# EAGLE design Enclosure 85x58 (EAGLE 9.6.1)
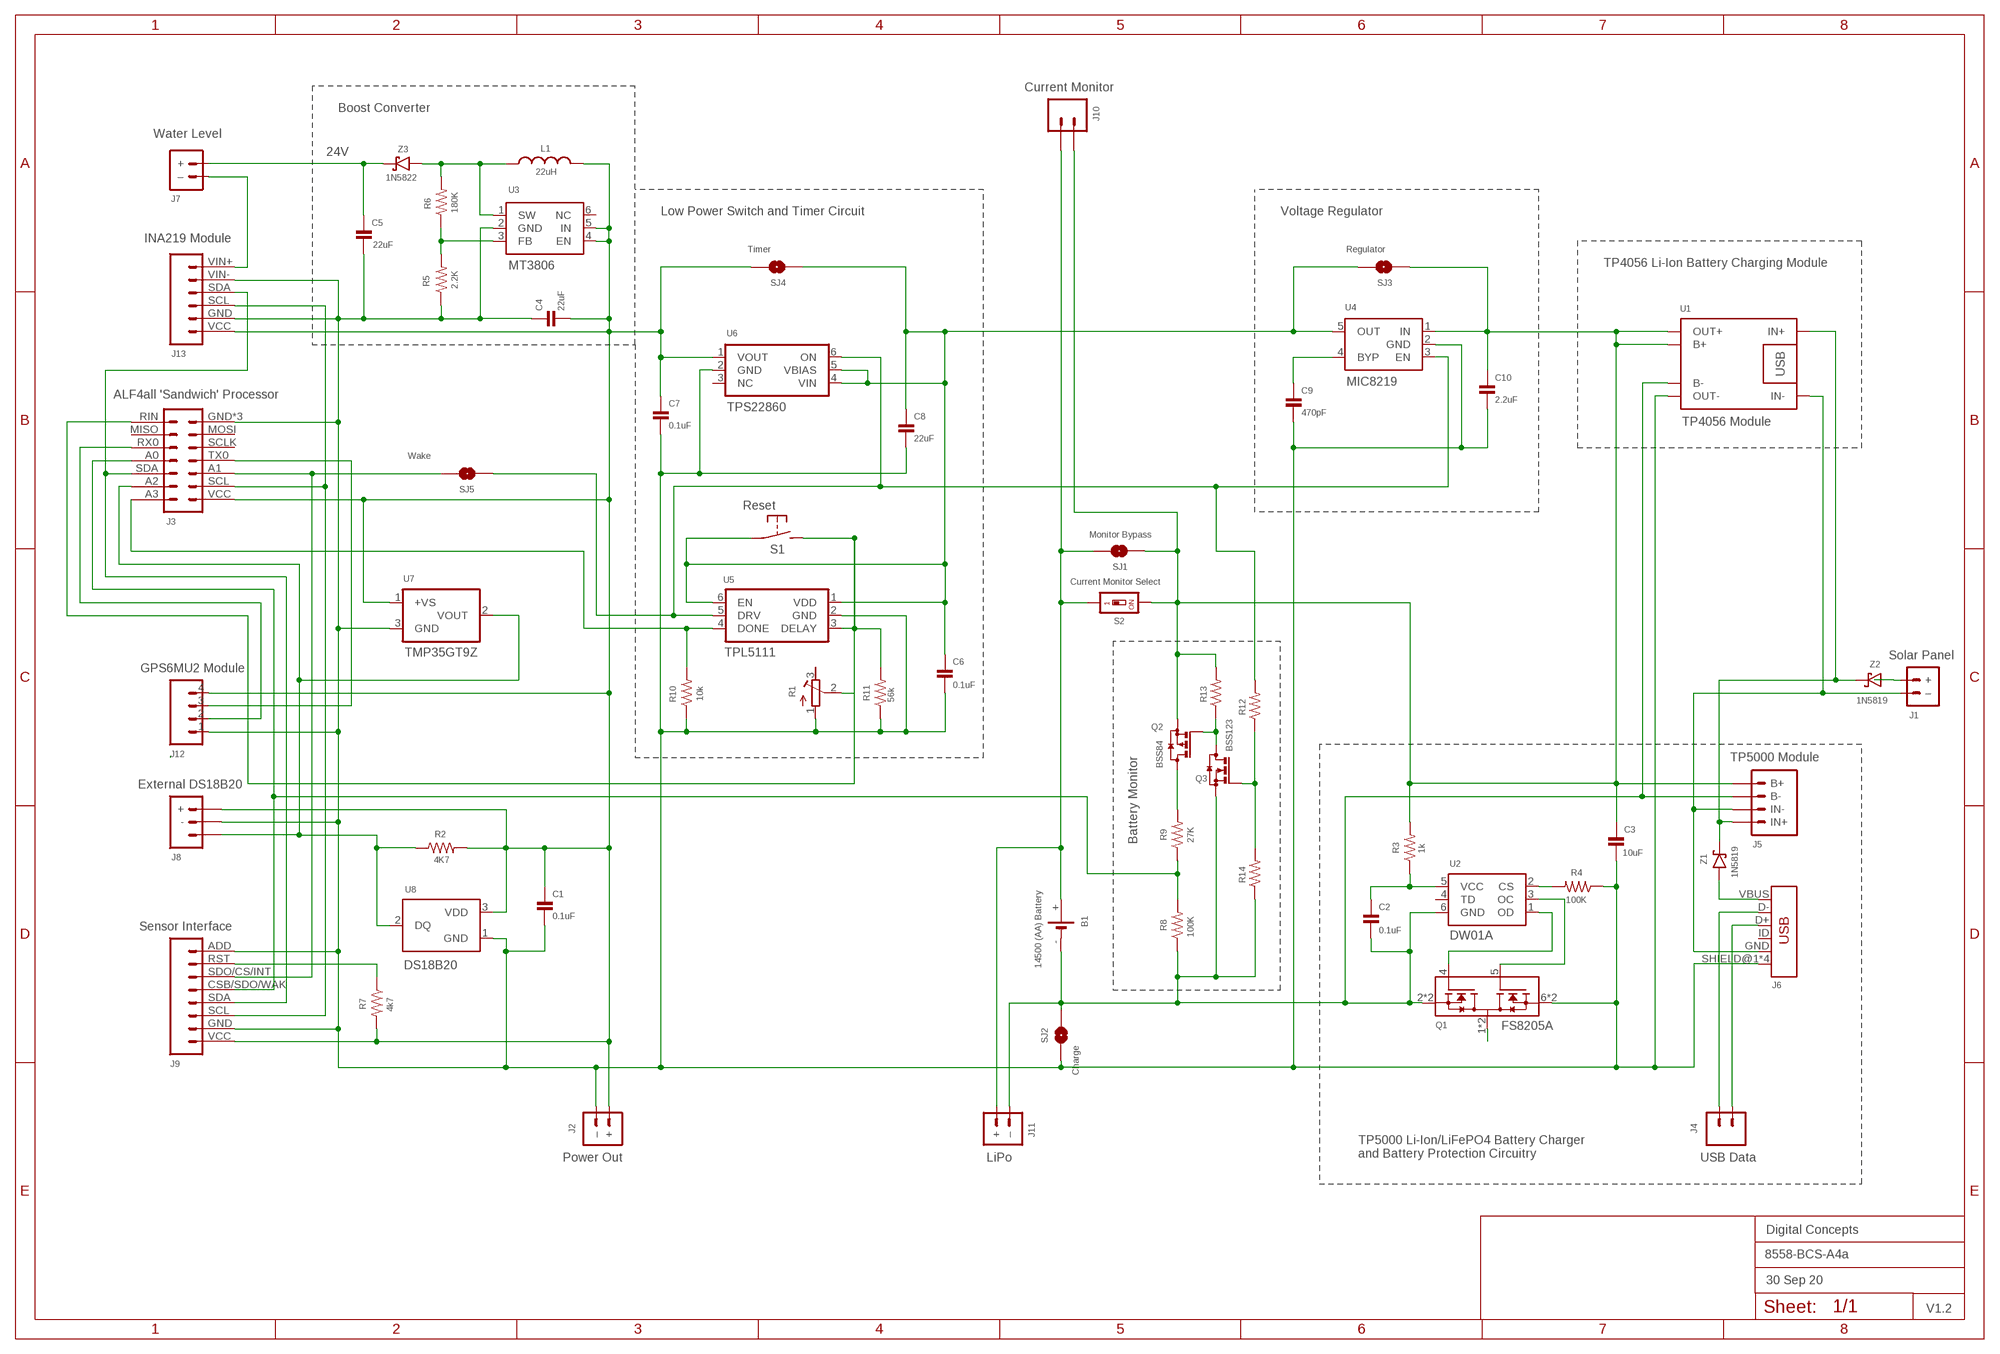
[diagram p0: schematic, sheet 1]
FRAME2 (A3L-LOC): DATE: 30 Sep 20; OWNER: Digital Concepts; TITLE: 8558-BCS-A4a; VERSION: V1.2

## Parts
B1  14500 (AA) Battery  BATTERY-HOLDER-14500(AA)  [BATTERY-14500]
C1  0.1uF  CAPACITOR-VIA-2  [C0805-VIA-2]
C2  0.1uF  CAPACITOR-VIA-1  [C0805-VIA-1]
C3  10uF  CAPACITOR-VIA-2  [C0805-VIA-2]
C4  22uF  CAPACITOR-VIA-1  [C0805-VIA-1]
C5  22uF  CAPACITOR  [C0805]
C6  0.1uF  CAPACITOR  [C0805]
C7  0.1uF  CAPACITOR-VIA-1  [C0805-VIA-1]
C8  22uF  CAPACITOR-VIA-2  [C0805-VIA-2]
C9  470pF  CAPACITOR  [C0805]
C10  2.2uF  CAPACITOR-VIA-2  [C0805-VIA-2]
J1  Solar Panel  JST-PH2.0-2-MALE-VERTICAL  [JST-PH2.0-2-VERTICAL]
J2  Power Out  JST-PH1.25-2-MALE  [JST-PH1.25-2]
J3  ALF4all 'Sandwich' Processor  HEADER-2X7-ALF4ALL-PROCESSOR  [CONN_2X7-ALF4ALL-PROCESSOR]
J4  USB Data  1X2-PIN-HEADER  [CONN_02-GENERIC]
J5  TP5000 Module  TP5000-MODULE  [CONN_04-GENERIC]
J6  USB  USB_MINI-B_SMT  [USB-MINIB]
J7  Water Level  JST-PH2.0-2-MALE-VERTICAL  [JST-PH2.0-2-VERTICAL]
J8  External DS18B20  JST-PH2.0-3-MALE-VERTICAL  [JST-PH2.0-3-VERTICAL]
J9  Sensor Interface  HEADER-1X8-SENSOR  [CONN_08-SENSOR]
J10  Current Monitor  JST-PH2.0-2-MALE-HORIZONTALJST-PTH-2  [JST-PH2.0-2-HORIZONTAL]
J11  LiPo  JST-PH2.0-2-MALE-VERTICAL  [JST-PH2.0-2-VERTICAL]
J12  GPS6MU2 Module  HEADER-1X4-GENERIC  [CONN_04-GENERIC]
J13  INA219 Module  INA219-I2C-MODULE  [CONN_06-INA219]
L1  22uH  INDUCTORL5038P  [L5038P]
Q1  FS8205A  [SOP65P640X120-8N]
Q2  BSS84  [SOT23]
Q3  BSS123  [SOT23]
R1  RESISTOR-TRIMM64W  [RTRIM64W]
R2  4K7  RESISTORR0805  [R0805]
R3  1k  RESISTORR0805  [R0805]
R4  100K  RESISTORR0805  [R0805]
R5  2.2K  RESISTOR-VIA-1  [R0805-VIA-1]
R6  180K  RESISTORR0805  [R0805]
R7  4k7  RESISTORR0805  [R0805]
R8  100K  RESISTORR0805  [R0805]
R9  27K  RESISTOR-VIA-12  [R0805-VIA-12]
R10  10k  RESISTOR-VIA-2  [R0805-VIA-2]
R11  56k  RESISTOR-VIA-1  [R0805-VIA-1]
R12  RESISTORR0805  [R0805]
R13  RESISTORR0805  [R0805]
R14  RESISTORR0805  [R0805]
S1  Reset  SWITCH-MOMENTARY-2-PIN-VIAS  [SWITCH-2-PAD-VIAS]
S2  Current Monitor Select  SWITCH-DIP-SWS001-VIA-1  [SMD-001-VIA-1]
SJ1  Monitor Bypass  SJ  [SJ]
SJ2  Charge  SJ-V-2  [SJ-VIA-2]
SJ3  Regulator  SJ-V-1  [SJ-VIA-1]
SJ4  Timer  SJ  [SJ]
SJ5  Wake  SJ-V-1  [SJ-VIA-1]
U1  TP4056 Module  BATTERY-CHARGER-LI-PROT  [BATTERY-CHARGER-LI-PROT]
U2  DW01A  [SOT23-6]
U3  MT3806  [SOT-23-6]
U4  MIC8219  MIC5219XX  [SOT-23-5]
U5  TPL5111  TPL5111DDCR  [SOT-23-6]
U6  TPS22860  [SOT-23-6]
U7  TMP35GT9Z  [TO-92]
U8  DS18B20  [TO-92]
Z1  1N5819  1N5819-SOD-123  [SOD-123]
Z2  1N5819  1N5819-SOD-123  [SOD-123]
Z3  1N5822  1N5819-SOD-123  [SOD-123]

## Nets
GND: C1.2 C1.2@VIA C3.2 C3.2@VIA C4.1 C4.1@VIA C5.2 C6.1 C7.1 C7.1@VIA C8.2 C8.2@VIA C9.2 C10.1 J2.-(–) J3.GND J3.GND@TL J3.GND@TR J6.SHIELD@1(SHIELD) J6.SHIELD@2(SHIELD) J6.SHIELD@3(SHIELD) J6.SHIELD@4(SHIELD) J8.- J9.ADD J9.GND J12.1 J13.GND J13.VIN- Q1.6(S2) Q1.7(S2) R1.1(A) R4.1 R5.1 R5.1@VIA R10.1 R11.1 R11.1@VIA SJ2.1 SJ2.1@V U1.OUT- U3.2(GND) U4.2(GND) U5.2(GND) U6.2(GND) U7.3(GND) U8.1(GND)
N$1: J1.+ Z2.A
N$2: J1.-(–) J5.2(IN-) J6.GND U1.IN-
N$3: R4.2 U2.2(CS)
N$4: Q1.1(D12) Q1.8(D12)
N$5: J5.1(IN+) U1.IN+ Z1.C Z2.C
N$6: L1.1 R6.2 U3.1(SW) Z3.A
N$7: C9.1 U4.4(BYP)
N$8: J3.SCL J9.SCL J13.SCL
N$9: J9.RST R7.1
N$10: J3.A0 J9.CSB/SDO/WAK R8.2 R9.1 R9.1@VIA
N$11: J3.SDA J9.SDA J13.SDA
N$12: B1.+ J10.+ J11.+ S2.1 S2.1@VIA SJ1.1
N$13: J3.A2 J8.SIG R2.1 U7.2(VOUT) U8.2(DQ)
N$14: J3.TX0 J12.3
N$15: J7.-(–) J13.VIN+
N$16: J3.RX0 J12.2
N$18: Q1.5(G2) U2.3(OC)
N$19: J6.VBUS Z1.A
N$20: Q1.4(G1) U2.1(OD)
N$21: J4.2 J6.D+
N$22: C2.1 C2.1@VIA R3.1 U2.5(VCC)
N$23: Q2.3(D) R9.2 R9.2@VIA
N$24: J4.1 J6.D-
N$25: J3.RIN R1.2(S) R11.2 S1.2(S) S1.2@VIA(S) U5.3(DELAY)
N$26: C6.2 C8.1 S1.1(P) S1.1@VIA(P) SJ3.2 SJ4.2 U4.5(OUT) U5.1(VDD) U5.6(EN) U6.4(VIN) U6.5(VBIAS)
N$28: R12.2 SJ5.2 U4.3(EN) U5.5(DRV) U6.6(ON)
N$29: J3.A3 R10.2 R10.2@VIA U5.4(DONE)
N$30: J3.A1 J9.SDO/CS/INT SJ5.1 SJ5.1@V
N$31: C5.1 J7.+ Z3.C
N$33: R5.2 R6.1 U3.3(FB)
N$34: C3.1 C10.2 C10.2@VIA J5.4(B+) J10.- Q2.2(S) R3.2 R13.2 S2.2 SJ1.2 SJ3.1 SJ3.1@V U1.B+ U1.OUT+ U4.1(IN)
N$35: Q2.1(G) Q3.3(D) R13.1
N$37: Q3.1(G) R12.1 R14.2
N$38: B1.- C2.2 J5.3(B-) J11.-(–) Q1.2(S1) Q1.3(S1) Q3.2(S) R8.1 R14.1 SJ2.2 SJ2.2@V U1.B- U2.6(GND)
VCC: C1.1 C4.2 C7.2 J2.+ J3.VCC J8.+ J9.VCC J12.4 J13.VCC L1.2 R2.2 R7.2 SJ4.1 U3.4(EN) U3.5(IN) U6.1(VOUT) U7.1(+VS) U8.3(VDD)
Unconnected: J3.MISO J3.MOSI J3.SCLK J6.ID R1.3(E) U2.4(TD) U3.6(NC) U6.3(NC)

## Notes on the sheet
- Boost Converter
- 24V
- Low Power Switch and Timer Circuit | Voltage Regulator
- TP4056 Li-Ion Battery Charging Module
- Battery Monitor
- TP5000 Li-Ion/LiFePO4 Battery Charger
  and Battery Protection Circuitry

## Library data of the parts
B1 = digitalconcepts:BATTERY-HOLDER-14500(AA): 14500 (AA) battery holder
C1 C3 C8 C10 = digitalconcepts:CAPACITOR-VIA-2: 0805 Capacitor with via on Pad 2
C2 C4 C7 = digitalconcepts:CAPACITOR-VIA-1: 0805 Capacitor with via
C5 C6 C9 = digitalconcepts:CAPACITOR: 0805 Capacitor
J1 J7 J11 = digitalconcepts:JST-PH2.0-2-MALE-VERTICAL: PH2.0 Male PCB Connector
J2 = digitalconcepts:JST-PH1.25-2-MALE: PH1.25 Male PCB Connector
J3 = digitalconcepts:HEADER-2X7-ALF4ALL-PROCESSOR: ALF4all 'Sandwixh' Processor 2x7 Pin Header and earthed 1x1 locator pins for ALF4all 'Sandwich' Processor/RFM95W PCBs
J4 = digitalconcepts:1X2-PIN-HEADER: Single Row 2-Pin Header
J5 = digitalconcepts:TP5000-MODULE: TP5000 Module Pin Header
J6 = digitalconcepts:USB_MINI-B: USB Mini-B Connector Breaks out 5 pins, and includes shield pins if needed.
J8 = digitalconcepts:JST-PH2.0-3-MALE-VERTICAL: PH2.0 Male PCB Connector
J9 = digitalconcepts:HEADER-1X8-SENSOR: IoT Sensors 1x8 Pin Header for 'Sandwich' IoT Sensors
J10 = digitalconcepts:JST-PH2.0-2-MALE-HORIZONTAL: Multi connection point. Often used as Generic Header-pin footprint for 0.1 inch spaced/style header connections On any of the 0.1 inch spaced packages, you can populate with these: Break Away Headers - Straight <https://www.sparkfun.com/products/116> (PRT-00116) Break Away Male Headers - Right Angle <https://www.sparkfun.com/products/553> (PRT-00553) Female Headers <https://www.sparkfun.com/products/115> (PRT-00115) Break Away Headers - Machine Pin <https://www.sparkfun.com/products/117> (PRT-00117) Break Away Female Headers - Swiss Machine Pin <https://www.sparkfun.com/products/743> (PRT-00743) For SCREWTERMINALS and SPRING TERMINALS visit here: Screw Terimnals on SparkFun.com <https://www.sparkfun.com/search/results?term=Screw+Terminals> (5mm/3.5mm/2.54mm spacing) This device is also useful as a general connection point to wire up your design to another part of your project. Our various solder wires solder well into these plated through hole pads. Hook-Up Wire - Assortment (Stranded, 22 AWG) <https://www.sparkfun.com/products/11375> (PRT-11375) Hook-Up Wire - Assortment (Solid Core, 22 AWG) <https://www.sparkfun.com/products/11367> (PRT-11367) View the entire wire category on our website here <https://www.sparkfun.com/categories/141> Special notes: Molex polarized connector foot print use with: PRT-08233 with associated crimp pins and housings. 2.54_SCREWTERM for use with PRT-10571. 3.5mm Screw Terminal footprints for PRT-08084 5mm Screw Terminal footprints for use with PRT-08432; PROD_ID: CONN-09863; SKU: PRT-09914
J12 = digitalconcepts:HEADER-1X4-GENERIC: Single Row 4-Pin Header
J13 = digitalconcepts:INA219-I2C-MODULE: INA219 I2C Module
L1 = digitalconcepts:INDUCTOR: Inductor; SPICEPREFIX: L
Q1 = FS8205A:FS8205A: N/A; AVAILABILITY: Unavailable; MF: Fortune Semiconductor; MP: FS8205A; PACKAGE: Package; PRICE: None
Q2 = digitalconcepts:BSS84: P-CHANNEL MOS FET
Q3 = digitalconcepts:BSS123: N-CHANNEL MOS FET
R1 = digitalconcepts:RESISTOR-TRIMM: Trimm resistor
R2-R4 R6-R8 R12-R14 = digitalconcepts:RESISTOR: Resistor; SPICEPREFIX: R
R5 R11 = digitalconcepts:RESISTOR-VIA-1: Resistor with via on Pad 1
R9 = digitalconcepts:RESISTOR-VIA-12: Resistor with vias on each pad
R10 = digitalconcepts:RESISTOR-VIA-2: Resistor with via on Pad 2
S1 = digitalconcepts:SWITCH-MOMENTARY-2-PIN-VIAS: 2 Pin Momentary Switch
S2 = digitalconcepts:SWITCH-DIP-SWS001-VIA-1: SMD Dip Switch 1 pol.
SJ1 SJ4 = digitalconcepts:SJ: Solder Jumper
SJ2 = digitalconcepts:SJ-V-2: Solder Jumper with Pad Vias
SJ3 SJ5 = digitalconcepts:SJ-V-1: Solder Jumper with single Pad Via
U1 = digitalconcepts:BATTERY-CHARGER-LI-PROT: TP4056 Li Battery Charger module with PCB (rather than module) footprint
U2 = DW01A:DW01A; AVAILABILITY: Unavailable; DESCRIPTION: One Cell Lithium-ion/Polymer Battery Protection IC; MF: Fortune Semiconductor; MP: DW01A; PACKAGE: SOT-23-6 Fortune Semiconductor; PRICE: None
U3 = digitalconcepts:MT3806: MT3806 DC-DC Step-Up Voltage Converter
U4 = digitalconcepts:MIC5219XX: VOLTAGE REGULATOR; OC_FARNELL: unknown; OC_NEWARK: unknown
U5 = digitalconcepts:TPL5111DDCR: TPL5111 Nano-Power System Timer
U6 = digitalconcepts:TPS22860: Texas Instruments TPS22860 Ultra-Low Leakage Load Switch
U7 = digitalconcepts:TMP35GT9Z: Temperature Sensor; AVAILABILITY: Warning; DESCRIPTION: Temperature Sensor Analog, Local 10°C ~ 125°C 10mV/°C TO-92-3; MF: Analog Devices; MOUSER-PURCHASE-URL: https://snapeda.com/shop?store=Mouser&id=409845; MP: TMP35GT9Z; PACKAGE: TO-92-3 Analog Devices; PRICE: None
U8 = digitalconcepts:DS18B20: Digital Thermometer -55C-125C TO92-3; AVAILABILITY: Bad; DESCRIPTION: Temperature Sensor Digital, Local -55°C ~ 125°C 12 b 8-uMAX; MF: Maxim Integrated; MP: DS18B20; PACKAGE: TO-92 Maxim Integrated; PRICE: None
Z1-Z3 = digitalconcepts:1N5819-SOD-123: 1N5819 Schottky Diode SOD-123

## Board
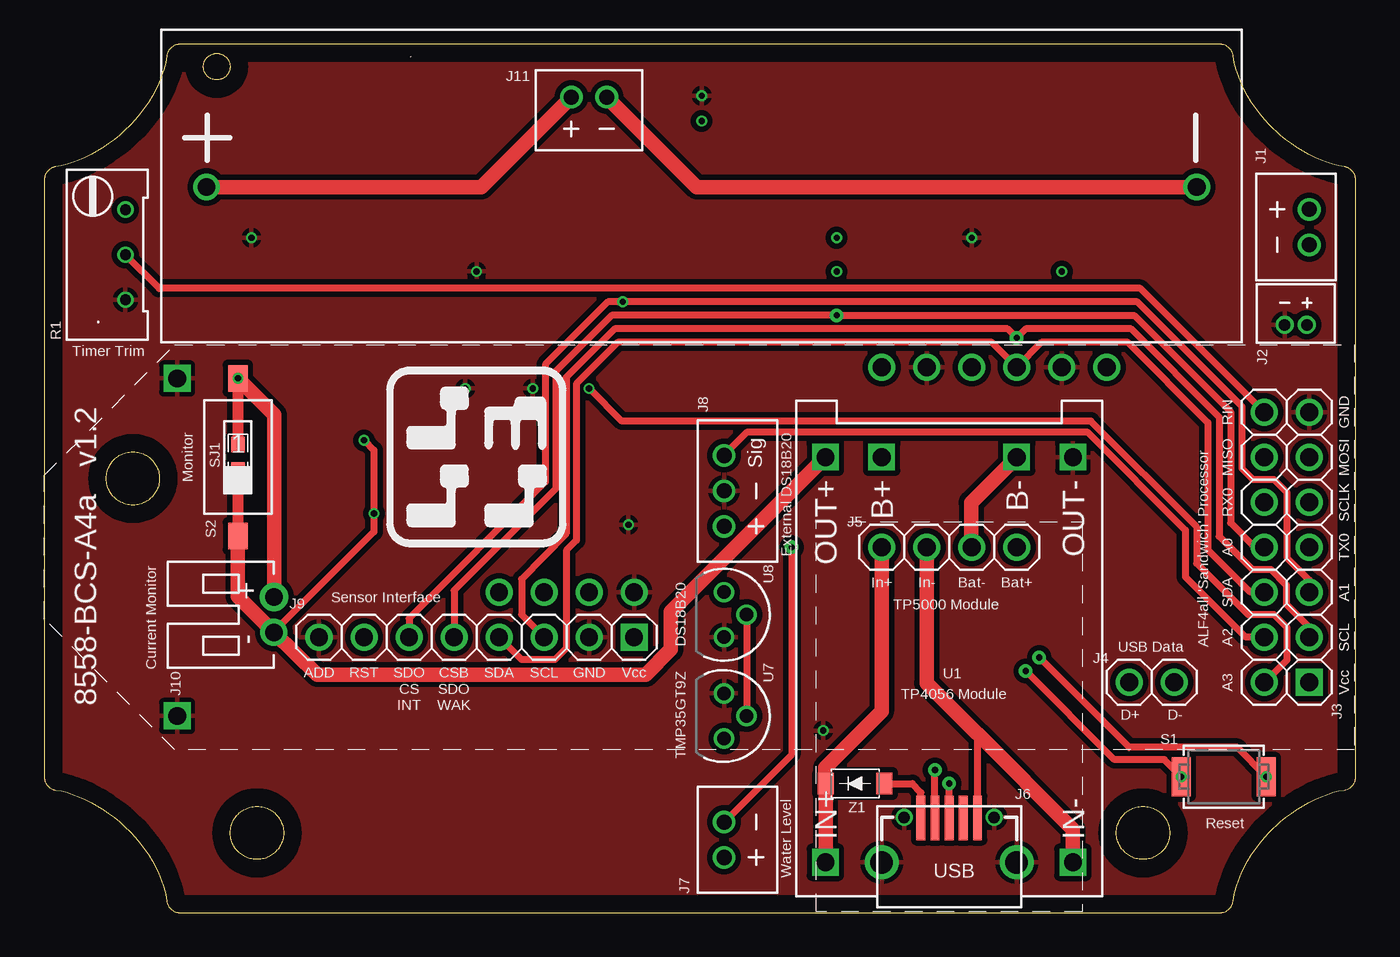
[diagram p1: board, top side]
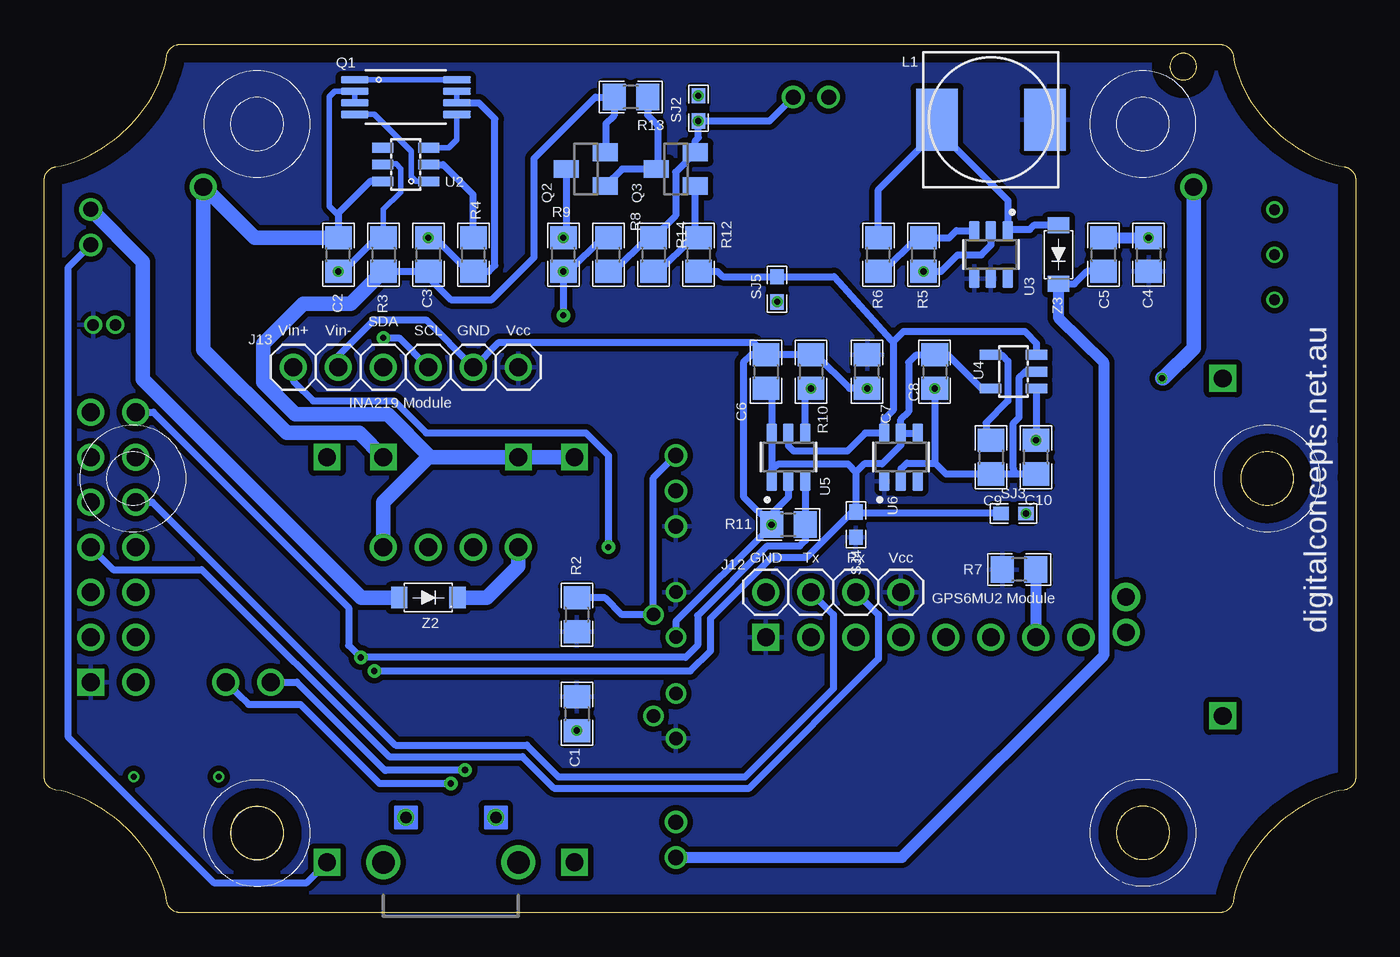
[diagram p2: board, bottom side, seen from below]

Size 74 x 49 mm. Coordinates in mm from the lower left corner, seen from the top.
Outline: 7.52,48.99 7.48,48.98 7.43,48.97 7.39,48.95 7.35,48.94 7.31,48.92 7.27,48.89 7.24,48.87 7.2,48.85 7.17,48.82 7.13,48.79 7.1,48.76 7.08,48.73 7.05,48.69 7.02,48.66 7,48.62 6.98,48.58 6.96,48.54 6.95,48.5 6.93,48.46 6.92,48.41 6.92,48.37 6.85,47.96 6.75,47.57 6.61,47.18 6.47,46.8 6.29,46.43 6.09,46.08 5.88,45.72 5.65,45.38 5.39,45.06 5.13,44.74 4.85,44.44 4.55,44.16 4.26,43.88 3.94,43.62 3.62,43.39 3.3,43.16 2.96,42.95 2.63,42.78 2.29,42.6 1.96,42.45 1.62,42.33 1.29,42.22 0.96,42.13 0.64,42.09 0.59,42.08 0.55,42.07 0.51,42.05 0.47,42.04 0.43,42.02 0.39,42 0.35,41.98 0.31,41.96 0.28,41.93 0.25,41.9 0.22,41.87 0.16,41.81 0.13,41.77 0.11,41.73 0.09,41.7 0.07,41.66 0.05,41.61 0.03,41.57 0.02,41.53 0.01,41.48 0,41.44 0,41.39 0,41.34 0,41.33 0,26.66 0,24.57 0,7.61 0,7.56 0.01,7.52 0.02,7.47 0.03,7.43 0.05,7.39 0.07,7.34 0.09,7.31 0.11,7.27 0.13,7.23 0.16,7.19 0.19,7.16 0.22,7.13 0.25,7.1 0.28,7.07 0.31,7.04 0.35,7.02 0.43,6.98 0.47,6.96 0.51,6.95 0.55,6.93 0.59,6.92 0.64,6.91 0.96,6.87 1.29,6.78 1.62,6.67 1.96,6.55 2.29,6.4 2.63,6.22 2.96,6.05 3.3,5.84 3.62,5.61 3.94,5.38 4.26,5.12 4.55,4.84 4.85,4.56 5.13,4.26 5.39,3.94 5.65,3.62 5.88,3.28 6.09,2.92 6.29,2.57 6.47,2.2 6.61,1.82 6.75,1.43 6.85,1.04 6.92,0.63 6.92,0.59 6.93,0.54 6.95,0.5 6.96,0.46 6.98,0.42 7,0.38 7.02,0.34 7.05,0.31 7.08,0.28 7.1,0.24 7.13,0.21 7.17,0.18 7.2,0.15 7.24,0.13 7.27,0.11 7.31,0.08 7.35,0.06 7.39,0.05 7.43,0.03 7.48,0.02 7.52,0.01 7.56,0 7.61,0 66.39,0 66.43,0 66.48,0.01 66.52,0.02 66.57,0.03 66.65,0.06 66.69,0.08 66.73,0.11 66.76,0.13 66.8,0.15 66.87,0.21 66.9,0.24 66.92,0.28 66.95,0.31 66.98,0.34 67.02,0.42 67.04,0.46 67.05,0.5 67.07,0.54 67.08,0.59 67.08,0.63 67.14,1.04 67.25,1.43 67.39,1.82 67.53,2.2 67.71,2.57 67.91,2.92 68.12,3.28 68.35,3.62 68.61,3.94 68.87,4.26 69.15,4.56 69.74,5.12 70.06,5.38 70.38,5.61 70.7,5.84 71.03,6.05 71.37,6.22 71.71,6.4 72.04,6.55 72.38,6.67 72.71,6.78 73.04,6.87 73.36,6.91 73.41,6.92 73.45,6.93 73.53,6.96 73.57,6.98 73.65,7.02 73.68,7.04 73.72,7.07 73.75,7.1 73.78,7.13 73.81,7.16 73.84,7.19 73.87,7.23 73.89,7.27 73.91,7.31 73.93,7.34 73.95,7.39 73.97,7.43 73.98,7.47 73.99,7.52 73.99,7.56 74,7.61 74,14.51 74,16.35 74,24.49 74,26.59 74,41.39 74,41.44 73.99,41.48 73.98,41.53 73.97,41.57 73.95,41.61 73.93,41.66 73.91,41.7 73.89,41.73 73.87,41.77 73.84,41.81 73.81,41.84 73.78,41.87 73.75,41.9 73.72,41.93 73.69,41.96 73.65,41.98 73.61,42 73.57,42.02 73.53,42.04 73.49,42.05 73.45,42.07 73.41,42.08 73.36,42.09 73.04,42.13 72.71,42.22 72.38,42.33 72.04,42.45 71.71,42.6 71.37,42.78 71.04,42.95 70.7,43.16 70.38,43.39 70.06,43.62 69.74,43.88 69.15,44.44 68.87,44.74 68.61,45.06 68.35,45.38 68.12,45.72 67.91,46.08 67.71,46.43 67.53,46.8 67.39,47.18 67.25,47.57 67.15,47.96 67.08,48.37 67.08,48.41 67.07,48.46 67.05,48.5 67.04,48.54 67.02,48.58 67,48.62 66.98,48.66 66.95,48.69 66.92,48.73 66.9,48.76 66.87,48.79 66.8,48.85 66.76,48.87 66.73,48.89 66.69,48.92 66.65,48.94 66.57,48.97 66.52,48.98 66.48,48.99 66.44,49 66.39,49 7.61,49 7.56,49 7.52,48.99
Outline: 62.3,5.97 62.4,5.95 62.49,5.92 62.58,5.88 62.67,5.84 62.76,5.8 62.84,5.74 62.92,5.69 62.99,5.63 63.13,5.49 63.19,5.42 63.24,5.34 63.3,5.26 63.34,5.17 63.38,5.08 63.42,4.99 63.45,4.9 63.47,4.8 63.49,4.71 63.5,4.6 63.5,4.4 63.49,4.3 63.47,4.2 63.45,4.1 63.42,4.01 63.38,3.92 63.34,3.83 63.3,3.74 63.24,3.66 63.19,3.58 63.13,3.51 62.99,3.37 62.92,3.31 62.84,3.26 62.76,3.2 62.67,3.16 62.58,3.12 62.49,3.08 62.4,3.05 62.3,3.03 62.2,3.01 62.1,3 61.9,3 61.8,3.01 61.7,3.03 61.6,3.05 61.51,3.08 61.42,3.12 61.33,3.16 61.24,3.2 61.08,3.31 61.01,3.37 60.87,3.51 60.81,3.58 60.76,3.66 60.7,3.74 60.66,3.83 60.62,3.92 60.58,4.01 60.55,4.1 60.53,4.2 60.51,4.3 60.5,4.4 60.5,4.6 60.51,4.71 60.53,4.8 60.55,4.9 60.58,4.99 60.62,5.08 60.66,5.17 60.7,5.26 60.76,5.34 60.81,5.42 60.87,5.49 61.01,5.63 61.08,5.69 61.16,5.74 61.24,5.8 61.33,5.84 61.42,5.88 61.51,5.92 61.6,5.95 61.7,5.97 61.8,5.99 61.9,6 62.1,6 62.2,5.99 62.3,5.97
Outline: 12.3,5.97 12.4,5.95 12.49,5.92 12.58,5.88 12.67,5.84 12.76,5.8 12.84,5.74 12.92,5.69 12.99,5.63 13.06,5.56 13.13,5.49 13.19,5.42 13.24,5.34 13.3,5.26 13.34,5.17 13.38,5.08 13.42,4.99 13.45,4.9 13.47,4.8 13.49,4.71 13.5,4.6 13.5,4.4 13.49,4.3 13.47,4.2 13.45,4.1 13.42,4.01 13.38,3.92 13.34,3.83 13.3,3.74 13.24,3.66 13.19,3.58 13.13,3.51 13.06,3.44 12.99,3.37 12.92,3.31 12.84,3.26 12.76,3.2 12.67,3.16 12.58,3.12 12.49,3.08 12.4,3.05 12.3,3.03 12.2,3.01 12.1,3 11.9,3 11.8,3.01 11.7,3.03 11.6,3.05 11.51,3.08 11.33,3.16 11.24,3.2 11.08,3.31 11.01,3.37 10.94,3.44 10.87,3.51 10.81,3.58 10.76,3.66 10.7,3.74 10.66,3.83 10.62,3.92 10.58,4.01 10.55,4.1 10.53,4.2 10.51,4.3 10.5,4.4 10.5,4.6 10.51,4.71 10.53,4.8 10.55,4.9 10.58,4.99 10.62,5.08 10.66,5.17 10.7,5.26 10.76,5.34 10.81,5.42 10.87,5.49 10.94,5.56 11.01,5.63 11.08,5.69 11.16,5.74 11.24,5.8 11.33,5.84 11.51,5.92 11.6,5.95 11.7,5.97 11.8,5.99 11.9,6 12.1,6 12.2,5.99 12.3,5.97
Outline: 4.7,23.03 4.6,23.05 4.51,23.08 4.42,23.12 4.33,23.16 4.24,23.2 4.16,23.26 4.08,23.31 4.01,23.37 3.94,23.44 3.87,23.51 3.81,23.58 3.76,23.66 3.7,23.74 3.66,23.83 3.62,23.92 3.58,24.01 3.55,24.1 3.53,24.2 3.51,24.3 3.5,24.4 3.5,24.6 3.51,24.7 3.53,24.8 3.55,24.9 3.58,24.99 3.62,25.08 3.66,25.17 3.7,25.26 3.76,25.34 3.81,25.42 3.87,25.49 4.01,25.63 4.08,25.69 4.16,25.74 4.24,25.8 4.33,25.84 4.42,25.88 4.51,25.92 4.6,25.95 4.7,25.97 4.79,25.99 4.9,26 5.1,26 5.2,25.99 5.3,25.97 5.4,25.95 5.49,25.92 5.58,25.88 5.67,25.84 5.76,25.8 5.84,25.74 5.92,25.69 5.99,25.63 6.13,25.49 6.19,25.42 6.24,25.34 6.3,25.26 6.34,25.17 6.38,25.08 6.42,24.99 6.45,24.9 6.47,24.8 6.49,24.7 6.5,24.6 6.5,24.4 6.49,24.3 6.47,24.2 6.45,24.1 6.42,24.01 6.38,23.92 6.34,23.83 6.3,23.74 6.24,23.66 6.19,23.58 6.13,23.51 6.06,23.44 5.99,23.37 5.92,23.31 5.84,23.26 5.76,23.2 5.67,23.16 5.58,23.12 5.49,23.08 5.4,23.05 5.3,23.03 5.2,23.01 5.1,23 4.9,23 4.79,23.01 4.7,23.03
Outline: 9.88,48.47 9.93,48.46 9.98,48.45 10.02,48.43 10.07,48.41 10.11,48.39 10.15,48.36 10.19,48.33 10.23,48.3 10.26,48.27 10.29,48.24 10.32,48.2 10.35,48.16 10.38,48.12 10.4,48.08 10.42,48.03 10.44,47.99 10.45,47.94 10.46,47.89 10.47,47.84 10.48,47.79 10.48,47.69 10.47,47.64 10.46,47.59 10.45,47.54 10.44,47.49 10.42,47.45 10.4,47.4 10.38,47.36 10.35,47.32 10.32,47.28 10.29,47.24 10.26,47.21 10.23,47.18 10.19,47.14 10.15,47.12 10.11,47.09 10.07,47.07 10.02,47.05 9.98,47.03 9.93,47.01 9.88,47 9.83,46.99 9.78,46.99 9.68,46.99 9.63,46.99 9.58,47 9.53,47.01 9.48,47.03 9.39,47.07 9.35,47.09 9.31,47.12 9.27,47.14 9.23,47.18 9.2,47.21 9.17,47.24 9.13,47.28 9.11,47.32 9.08,47.36 9.06,47.4 9.04,47.45 9.02,47.49 9.01,47.54 9,47.59 8.99,47.64 8.98,47.69 8.98,47.79 8.99,47.84 9,47.89 9.01,47.94 9.02,47.99 9.04,48.03 9.06,48.08 9.08,48.12 9.11,48.16 9.13,48.2 9.17,48.24 9.2,48.27 9.23,48.3 9.27,48.33 9.31,48.36 9.35,48.39 9.39,48.41 9.44,48.43 9.48,48.45 9.53,48.46 9.58,48.47 9.63,48.48 9.68,48.49 9.78,48.49 9.83,48.48 9.88,48.47
Copper layers (1*16): Top 0.035mm / dielectric 1.5mm / Bottom 0.035mm
Design rules "default *": minimum track width 6mil, minimum drill 0.35mm, track to track 6mil, track to pad 6mil, pad to pad 6mil, via to via 6mil, smd to smd 6mil, copper to edge 40mil, drill to drill 6mil, minimum pad ring 1mil, minimum via ring 8mil, stop-mask expansion 4mil, vias tented up to drill 0mil, thermal gap 10mil

### Footprints (pad centres in the part's own frame; a part is rotated, then mirrored left to right if it is on the bottom)
BATTERY-14500 = drill 1: + -27.94,0; - 27.94,0
C0805-VIA-2 = smd 1.3 x 1.5: 1 -0.95,0; 2 0.95,0 | drill 0.35 pad 0.61: 2@VIA 0.95,0
C0805-VIA-1 = smd 1.3 x 1.5: 1 -0.95,0; 2 0.95,0 | drill 0.35 pad 0.61: 1@VIA -0.95,0
C0805 = smd 1.3 x 1.5: 1 -0.95,0; 2 0.95,0
JST-PH2.0-2-VERTICAL = drill 0.85: + -1,0; - 1,0
JST-PH1.25-2 = drill 0.65 pad 1.016: + -0.625,0; - 0.625,0
CONN_2X7-ALF4ALL-PROCESSOR = drill 1 pad 1.524: A0 7.62,2.54; A1 5.08,0; A2 2.54,2.54; A3 0,2.54; GND 15.24,0; MISO 12.7,2.54; MOSI 12.7,0; RIN 15.24,2.54; RX0 10.16,2.54; SCL 2.54,0; SCLK 10.16,0; SDA 5.08,2.54; TX0 7.62,0 | drill 1 pad 1.524 square: GND@TL -1.905,63.881; GND@TR 17.145,63.881; VCC 0,0
CONN_02-GENERIC = drill 1 pad 1.524: 1 0,0; 2 2.54,0
CONN_04-GENERIC = drill 1 pad 1.524: 1 0,0; 2 2.54,0; 3 5.08,0; 4 7.62,0
USB-MINIB = smd 2.5 x 0.5: D+ 2.5,0; D- 2.5,0.8; GND 2.5,-1.6; ID 2.5,-0.8; VBUS 2.5,1.6 | drill 1.27: SHIELD@1 0,3.81; SHIELD@2 0,-3.81 | drill 0.65 pad 0.762: SHIELD@3 2.54,2.54; SHIELD@4 2.54,-2.54
JST-PH2.0-3-VERTICAL = drill 0.85: + -2,0; - 0,0; SIG 2,0
CONN_08-SENSOR = drill 1 pad 1.524: ADD 17.78,0; CSB/SDO/WAK 10.16,0; GND 2.54,0; RST 15.24,0; SCL 5.08,0; SDA 7.62,0; SDO/CS/INT 12.7,0 | drill 1 pad 1.524 square: VCC 0,0
JST-PH2.0-2-HORIZONTAL = drill 1 pad 1.6: + 1,0 | drill 1 pad 1.524: - -1,0
CONN_06-INA219 = drill 1 pad 1.524: GND 2.54,0; SCL 5.08,0; SDA 7.62,0; VCC 0,0; VIN+ 12.7,0; VIN- 10.16,0
L5038P = smd 2.35 x 3.5: 1 -3.048,0; 2 3.048,0
SOP65P640X120-8N = smd 1.56 x 0.4: 1 -2.88,0.975; 2 -2.88,0.325; 3 -2.88,-0.325; 4 -2.88,-0.975; 5 2.88,-0.975; 6 2.88,-0.325; 7 2.88,0.325; 8 2.88,0.975
SOT23 = smd 1 x 1.4: 1 -0.95,-1.1; 2 0.95,-1.1; 3 0,1.1
RTRIM64W = drill 0.61: 1 1.27,-2.54; 2 1.27,0; 3 1.27,2.54
R0805 = smd 1.3 x 1.5: 1 -0.95,0; 2 0.95,0
R0805-VIA-1 = smd 1.3 x 1.5: 1 -0.95,0; 2 0.95,0 | drill 0.35 pad 0.61: 1@VIA -0.95,0
R0805-VIA-12 = smd 1.3 x 1.5: 1 -0.95,0; 2 0.95,0 | drill 0.35 pad 0.61: 1@VIA -0.95,0; 2@VIA 0.95,0
R0805-VIA-2 = smd 1.3 x 1.5: 1 -0.95,0; 2 0.95,0 | drill 0.35 pad 0.61: 2@VIA 0.95,0
SWITCH-2-PAD-VIAS = smd 1.067 x 2.184: 1 -2.4,0; 2 2.4,0 | drill 0.35 pad 0.61: 1@VIA -2.4,0; 2@VIA 2.4,0
SMD-001-VIA-1 = smd 1.1 x 1.5: 1 0,-4.45; 2 0,4.45 | drill 0.35 pad 0.61: 1@VIA 0,-4.45
SJ = smd 0.864 x 0.762: 1 -0.711,0; 2 0.711,0
SJ-VIA-2 = smd 0.864 x 0.762: 1 -0.711,0; 2 0.711,0 | drill 0.35 pad 0.61: 1@V -0.711,0; 2@V 0.711,0
SJ-VIA-1 = smd 0.864 x 0.762: 1 -0.711,0; 2 0.711,0 | drill 0.35 pad 0.61: 1@V -0.711,0
BATTERY-CHARGER-LI-PROT = drill 1 square: B+ 10.795,3.81; B- 10.795,-3.81; IN+ -12.065,6.985; IN- -12.065,-6.985; OUT+ 10.795,6.985; OUT- 10.795,-6.985
SOT23-6 = smd 0.55 x 1.2: 1 -0.95,-1.3; 2 0,-1.3; 3 0.95,-1.3; 4 0.95,1.3; 5 0,1.3; 6 -0.95,1.3
SOT-23-6 = smd 1.1 x 0.6: 1 -1.35,0.95; 2 -1.35,0; 3 -1.35,-0.95; 4 1.35,-0.95; 5 1.35,0; 6 1.35,0.95
SOT-23-5 = smd 0.55 x 1.2: 1 -0.95,-1.3; 2 0,-1.3; 3 0.95,-1.3; 4 0.95,1.3; 5 -0.95,1.3
TO-92 = drill 0.762: 1 1.27,0; 2 0,1.27; 3 -1.27,0
SOD-123 = smd 0.91 x 1.22: A -1.65,0; C 1.65,0

### Placement (x,y rotation side)
B1  37.09,40.94 0 top
C1  43.95,11.22 270 bottom
C2  57.41,37.13 90 bottom
C3  52.33,37.13 90 bottom
C4  11.69,37.13 270 bottom
C5  14.23,37.13 90 bottom
C6  33.28,30.53 270 bottom
C7  27.57,30.53 90 bottom
C8  23.76,30.53 270 bottom
C9  20.58,25.7 270 bottom
C10  18.04,25.7 90 bottom
J1  71.38,38.68 270 top
J2  70.62,33.17 180 top
J3  71.38,13 90 top
J4  61.22,13 0 top
J5  47.25,20.62 0 top
J6  51.06,2.84 90 top
J7  38.36,4.11 90 top
J8  38.36,23.8 90 top
J9  33.28,15.54 180 top
J10  12.96,16.81 90 top
J11  30.74,46.02 0 top
J12  33.28,18.08 0 bottom
J13  47.25,30.78 180 bottom
L1  20.58,44.75 0 bottom
Q1  53.6,46.02 0 bottom
Q2  43.44,41.96 90 bottom
Q3  38.36,41.96 90 bottom
R1  3.31,37.13 0 top
R2  43.95,16.81 270 bottom
R3  54.87,37.13 270 bottom
R4  49.79,37.13 90 bottom
R5  24.39,37.13 90 bottom
R6  26.93,37.13 90 bottom
R7  18.99,19.35 180 bottom
R8  42.17,37.13 90 bottom
R9  44.71,37.13 90 bottom
R10  30.74,30.53 270 bottom
R11  32.01,21.89 0 bottom
R12  37.09,37.13 270 bottom
R13  40.9,46.02 180 bottom
R14  39.63,37.13 270 bottom
S1  66.55,7.67 0 top
S2  10.93,25.7 180 top
SJ1  10.93,25.7 270 top
SJ2  37.09,45.39 270 bottom
SJ3  19.31,22.53 180 bottom
SJ4  28.2,21.89 90 bottom
SJ5  32.65,35.18 90 bottom
U1  51.06,14.91 90 top
U2  53.6,42.21 90 bottom
U3  20.58,37.13 270 bottom
U4  19.31,30.53 90 bottom
U5  32.01,25.7 90 bottom
U6  25.66,25.7 90 bottom
U7  38.36,11.1 270 top
U8  38.36,16.81 270 top
Z1  45.75,7.29 180 top
Z2  52.33,17.78 0 bottom
Z3  16.77,37.13 270 bottom

### Tracks (layer width: path | path; a pad name or v marks a point on that pad's centre or on a via)
GND
  Bottom 0.305: Q1.7 Q1.6
  Bottom 0.406: R5.1@VIA 23.4,36.18 22.46,37.12 21.13,37.12 20.58,37.67 U3.2 | C3.2@VIA 51.97,38.08 50.07,36.18 R4.1 48.91,36.18 48.57,36.52 48.57,44.79 49.48,45.7 Q1.6 | C6.1 R10.1 30.46,31.48 28.56,29.58 C7.1@VIA | U5.2 32.01,23.45 32.96,22.5 R11.1@VIA | U4.2 18.65,30.53 19,30.17 19,27.94 19.31,27.63 19.31,25.06 19.26,24.75 C10.1 C9.2 23.11,24.75 23.76,25.39 | C8.2@VIA 23.76,25.39 | J13.VIN- 57.41,31.42 55.38,33.45 52.45,33.45 J13.GND 49.75,30.78 48.35,32.18 34.01,32.18 C6.1 | R11.1@VIA 33.15,21.64 38.36,16.43 U8.1 | C6.1 34.12,31.48 34.55,31.05 34.55,23.48 R11.1@VIA | U6.2 25.65,24.37 25.65,25.06 25.33,25.37 23.78,25.37 23.76,25.39
  Bottom 0.61: C5.2 C4.1@VIA
  pour Top (isolate 0.305): -1.44,50.36 -1.44,-1.54 75.56,-1.54 75.56,50.36
N$1
  Bottom 0.813: J1.+ 68.43,36.74 68.43,30.1 56.11,17.78 Z2.A
N$2
  Top 0.406: J6.GND 52.66,10.08 52.62,10.12
  Top 0.813: U1.IN- 58.05,4.7 52.66,10.08 | J5.2 49.79,12.95 52.62,10.12
  Bottom 0.406: U1.IN- 59.19,1.7 64.45,1.7 72.68,9.93 72.68,36.39 J1.-
N$3
  Bottom 0.406: U2.2 51.49,42.21 49.82,40.54 49.82,38.11 R4.2
N$4
  Bottom 0.305: Q1.8 Q1.1
N$5
  Top 0.406: U1.IN+ 44.1,2.87 | Z1.C 44.08,7.23
  Top 0.813: 44.1,2.87 Z1.C | 44.08,7.23 44.08,8.18 47.25,11.35 J5.1
  Bottom 0.813: J5.1 47.25,19.56 49.03,17.78 Z2.C
N$6
  Bottom 0.406: R6.2 26.93,40.8 23.63,44.1 L1.1 23.63,44.19 19.63,40.19 U3.1 19.63,38.56 18.39,38.56 18.17,38.78 Z3.A
N$7
  Bottom 0.406: U4.4 19.98,31.48 19.62,31.12 19.62,28.88 20.86,27.64 20.86,26.47 20.83,26.5 C9.1
N$8  (via drill 0.35)
  Top 0.406: J3.SCL 71.38,16.1 70.09,17.4 70.09,18.49 69.22,19.35 68.18,19.35 66.3,21.23 66.3,27.96 61.32,32.94 55.38,32.94 v54.87,32.43 54.36,32.94 32.19,32.94 29.45,30.2 29.45,21.38 26.93,18.82 26.93,16.81 J9.SCL
  Bottom 0.406: v54.87,32.43 53.98,32.43 J13.SCL
N$9
  Bottom 0.61: R7.1 J9.RST
N$10  (via drill 0.35)
  Top 0.406: J9.CSB/SDO/WAK 23.12,18.18 28.86,23.92 28.86,30.55 32.01,33.7 v44.71,33.7 61.5,33.7 66.94,28.27 66.94,21.99 68.31,20.62 J3.A0
  Bottom 0.406: R8.2 42.5,38.08 44.4,36.18 R9.1@VIA v44.71,33.7
N$11
  Top 0.406: J3.SDA 68.05,18.08 65.67,20.47 65.67,27.66 61.14,32.18 56.27,32.18 J13.SDA 53.47,32.18 32.37,32.18 30.03,29.84 30.03,21 29.46,20.44 29.46,14.93 28.81,14.27 26.93,14.27 J9.SDA
N$12
  Top 0.61: S2.1@VIA SJ1.1
  Top 0.813: S2.1@VIA 12.99,28.1 12.99,18.11 J10.+ | B1.+ 24.66,40.94 J11.+
  Bottom 0.813: B1.+ 9.15,31.85 10.85,30.15 S2.1@VIA
N$13
  Top 0.406: J3.A2 67.8,15.54 64.4,18.95 64.4,21.59 58.88,27.1 39.63,27.1 38.34,25.8 J8.SIG | U8.2 U7.2
  Bottom 0.406: J8.SIG 39.63,24.53 U8.2 41.41,16.81 42.36,17.76 R2.1
N$14
  Bottom 0.406: J12.3 26.93,16.81 26.93,14.32 34.22,7.03 45.24,7.03 47.02,8.81 54.54,8.81 65.12,19.35 70.11,19.35 J3.TX0
N$15  (via drill 0.35)
  Top 0.406: J7.- 42.17,8.92 v42.17,20.62
  Bottom 0.406: v42.17,20.62 42.17,25.8 43.44,27.07 52.46,27.07 54.26,28.88 58.83,28.88 59.95,30 J13.VIN+
N$16
  Bottom 0.406: J3.RX0 67.9,23.16 54.18,9.45 46.77,9.45 44.99,7.67 34.45,7.67 29.47,12.65 29.47,16.81 J12.2
N$18
  Bottom 0.305: Q1.5 50.73,43.6 51.17,43.16 U2.3
N$19
  Top 0.406: Z1.A 48.99,7.29 49.46,6.77 J6.VBUS
N$20
  Bottom 0.305: U2.1 53.04,41.26 53.29,41.52 53.29,42.96 55.37,45.05 Q1.4
N$21  (via drill 0.35)
  Top 0.406: J6.D+ v51.06,7.29
  Bottom 0.406: J4.2 62.47,11.76 59.54,11.76 55.07,7.29 v51.06,7.29
N$22
  Bottom 0.305: U2.5 54.86,42.25 54.15,42.25 53.89,41.99 53.89,40.66 54.87,39.69 R3.1
  Bottom 0.406: C2.1@VIA 57.13,36.18 55.23,38.08 R3.1
N$23
  Bottom 0.406: Q2.3 44.56,41.56 44.56,38.23 R9.2@VIA
N$24  (via drill 0.35)
  Top 0.406: J6.D- v50.26,8.05
  Bottom 0.406: J4.1 59.75,13.01 54.78,8.03 54.66,8.05 v50.26,8.05
N$25  (via drill 0.35)
  Top 0.406: R1.2 6.48,35.23 61.86,35.23 J3.RIN | v56.14,14.4 61.22,9.32 67.32,9.32 S1.2@VIA
  Bottom 0.406: U5.3 R11.2 31.06,21 31.37,20.7 33.19,20.7 37.13,16.76 37.13,15.09 37.82,14.4 v56.14,14.4 56.83,15.09 56.83,17.22 67.85,28.24 J3.RIN
N$26  (via drill 0.35)
  Top 0.406: S1.1@VIA 63.2,8.63 60.38,8.63 v55.38,13.64
  Bottom 0.406: C6.2 32.96,29.33 U5.6 U5.1 32.96,24.99 32.58,25.32 28.66,25.32 28.2,24.86 | U6.5 U6.4 | SJ4.2 28.12,22.53 SJ3.2 | U6.5 25.66,27.84 25.23,28.27 25.23,31.04 24.8,31.48 C8.1 23.02,31.48 21.11,29.57 20.62,29.57 U4.5 | v55.38,13.64 37.54,13.64 36.4,14.78 36.4,16.61 32.95,20.06 30.97,20.06 28.43,22.6 SJ4.2 | 28.2,24.86 SJ4.2 | U6.5 25.66,26.39 26.73,25.32 27.74,25.32 28.2,24.86
N$28
  Bottom 0.406: U5.5 32.01,26.34 31.73,26.06 28.67,26.06 27.68,27.05 U6.6 26.61,27.84 26.1,28.35 26.1,32.19 | U4.3 18.01,32.11 18.65,32.79 25.53,32.79 26.1,32.21 26.1,32.19 | 26.1,32.19 26.23,32.33 29.43,35.89 SJ5.2 35.73,35.89 36.02,36.18 R12.2
N$29
  Top 0.406: J3.A3 68.87,13 70.11,14.25 70.11,16.1 69.4,16.81 67.93,16.81 65.03,19.71 65.03,21.77 59.06,27.73 32.58,27.73 R10.2@VIA
  Bottom 0.406: U5.4 31.06,29.33 R10.2@VIA
N$30
  Top 0.406: J3.A1 71.38,18.77 70.11,20.04 70.11,23.72 69.4,24.43 68.21,24.43 67.57,25.07 67.57,28.57 61.68,34.47 SJ5.1@V 31.81,34.47 28.28,30.93 28.28,24.31 20.58,16.61 J9.SDO/CS/INT
N$31
  Bottom 0.406: Z3.C 15.87,35.48 15.17,36.18 C5.1
  Bottom 0.61: Z3.C 16.77,33.57 14.23,31.06 14.23,14.5 25.61,3.12 J7.+
N$33
  Bottom 0.406: U3.3 22.54,38.49 22.94,38.08 R5.2 24.75,38.08 26.65,36.18 R6.1
N$34
  Top 0.406: J10.- 12.96,15.85 18.6,21.49 SJ3.1 18.6,26.09 C10.2@VIA
  Top 0.61: SJ1.2 10.93,21.28
  Top 0.813: 10.93,21.28 10.95,21.25 S2.2 10.93,17.84 J10.- 15.41,13.43 33.94,13.43 35.36,14.85 35.36,16.99 U1.OUT+
  Bottom 0.406: U4.1 18.03,29.56 18.03,26.67 C10.2@VIA | Q2.2 42.31,42.94 42.31,44.52 41.85,44.98 R13.2 42.91,46.02 46.36,42.57 46.36,36.97 48.74,34.59 51.06,34.59 52.33,35.86 C3.1 R3.2
  Bottom 0.813: U1.OUT+ U1.B+ 52.32,25.71 | R3.2 56.7,34.35 59.39,34.35 61.65,32.09 61.65,29.92 59.85,28.11 54.62,28.11 52.27,25.76 52.32,25.71 | 52.32,25.71 54.87,23.16 J5.4
N$35
  Bottom 0.406: R13.1 39.95,45.01 39.38,44.44 39.38,42.03 Q3.3 41.39,41.96 Q2.1
N$37
  Bottom 0.406: R14.2 39.6,36.15 39.35,36.15 37.42,38.08 R12.1 37.29,38.29 37.29,40.98 Q3.1
N$38
  Top 0.813: U1.B- 52.31,23.14 52.31,20.65 J5.3 | J11.- 36.82,40.94 B1.-
  Bottom 0.305: Q1.3 Q1.2 57.6,46.35 57.92,46.03 57.92,39.87 57.41,39.36
  Bottom 0.406: R8.1 41.86,36.18 39.96,38.08 R14.1 38.38,39.34 38.38,41.79 Q3.2 37.26,43.57 37.09,43.74 SJ2.2@V 33.08,44.68 J11.- | U2.6 55.61,41.26 57.41,39.46 57.41,39.36 C2.2
  Bottom 0.813: U1.B- 56.24,27.07 60.33,27.07 65.03,31.77 B1.- 64.98,40.94 62.12,38.08 C2.2
VCC
  pour Bottom (isolate 0.305): -0.44,49.36 -0.44,-0.54 74.56,-0.54 74.56,49.36

### Text on the board
tPlace: RIN | GND | MISO | MOSI | RX0 | SCLK | A0 | TX0 | 8558-BCS-A4a v1.2 | In+ | In- | Bat- | Bat+ | SDA | A1 | A2 | SCL | ADD | RST | SDA | SCL | GND | Vcc | A3 | Vcc | SDO / CS / INT | CSB / SDO / WAK | D+ | D-
bPlace: SDA | Vcc | GND | SCL | Vin- | Vin+ | digitalconcepts.net.au | Vcc | Rx | Tx | GND
tNames: Timer Trim | Monitor | TP5000 Module | TP4056 Module